# Altium schematic sheet CTRL V5.2.SchDoc
size A3
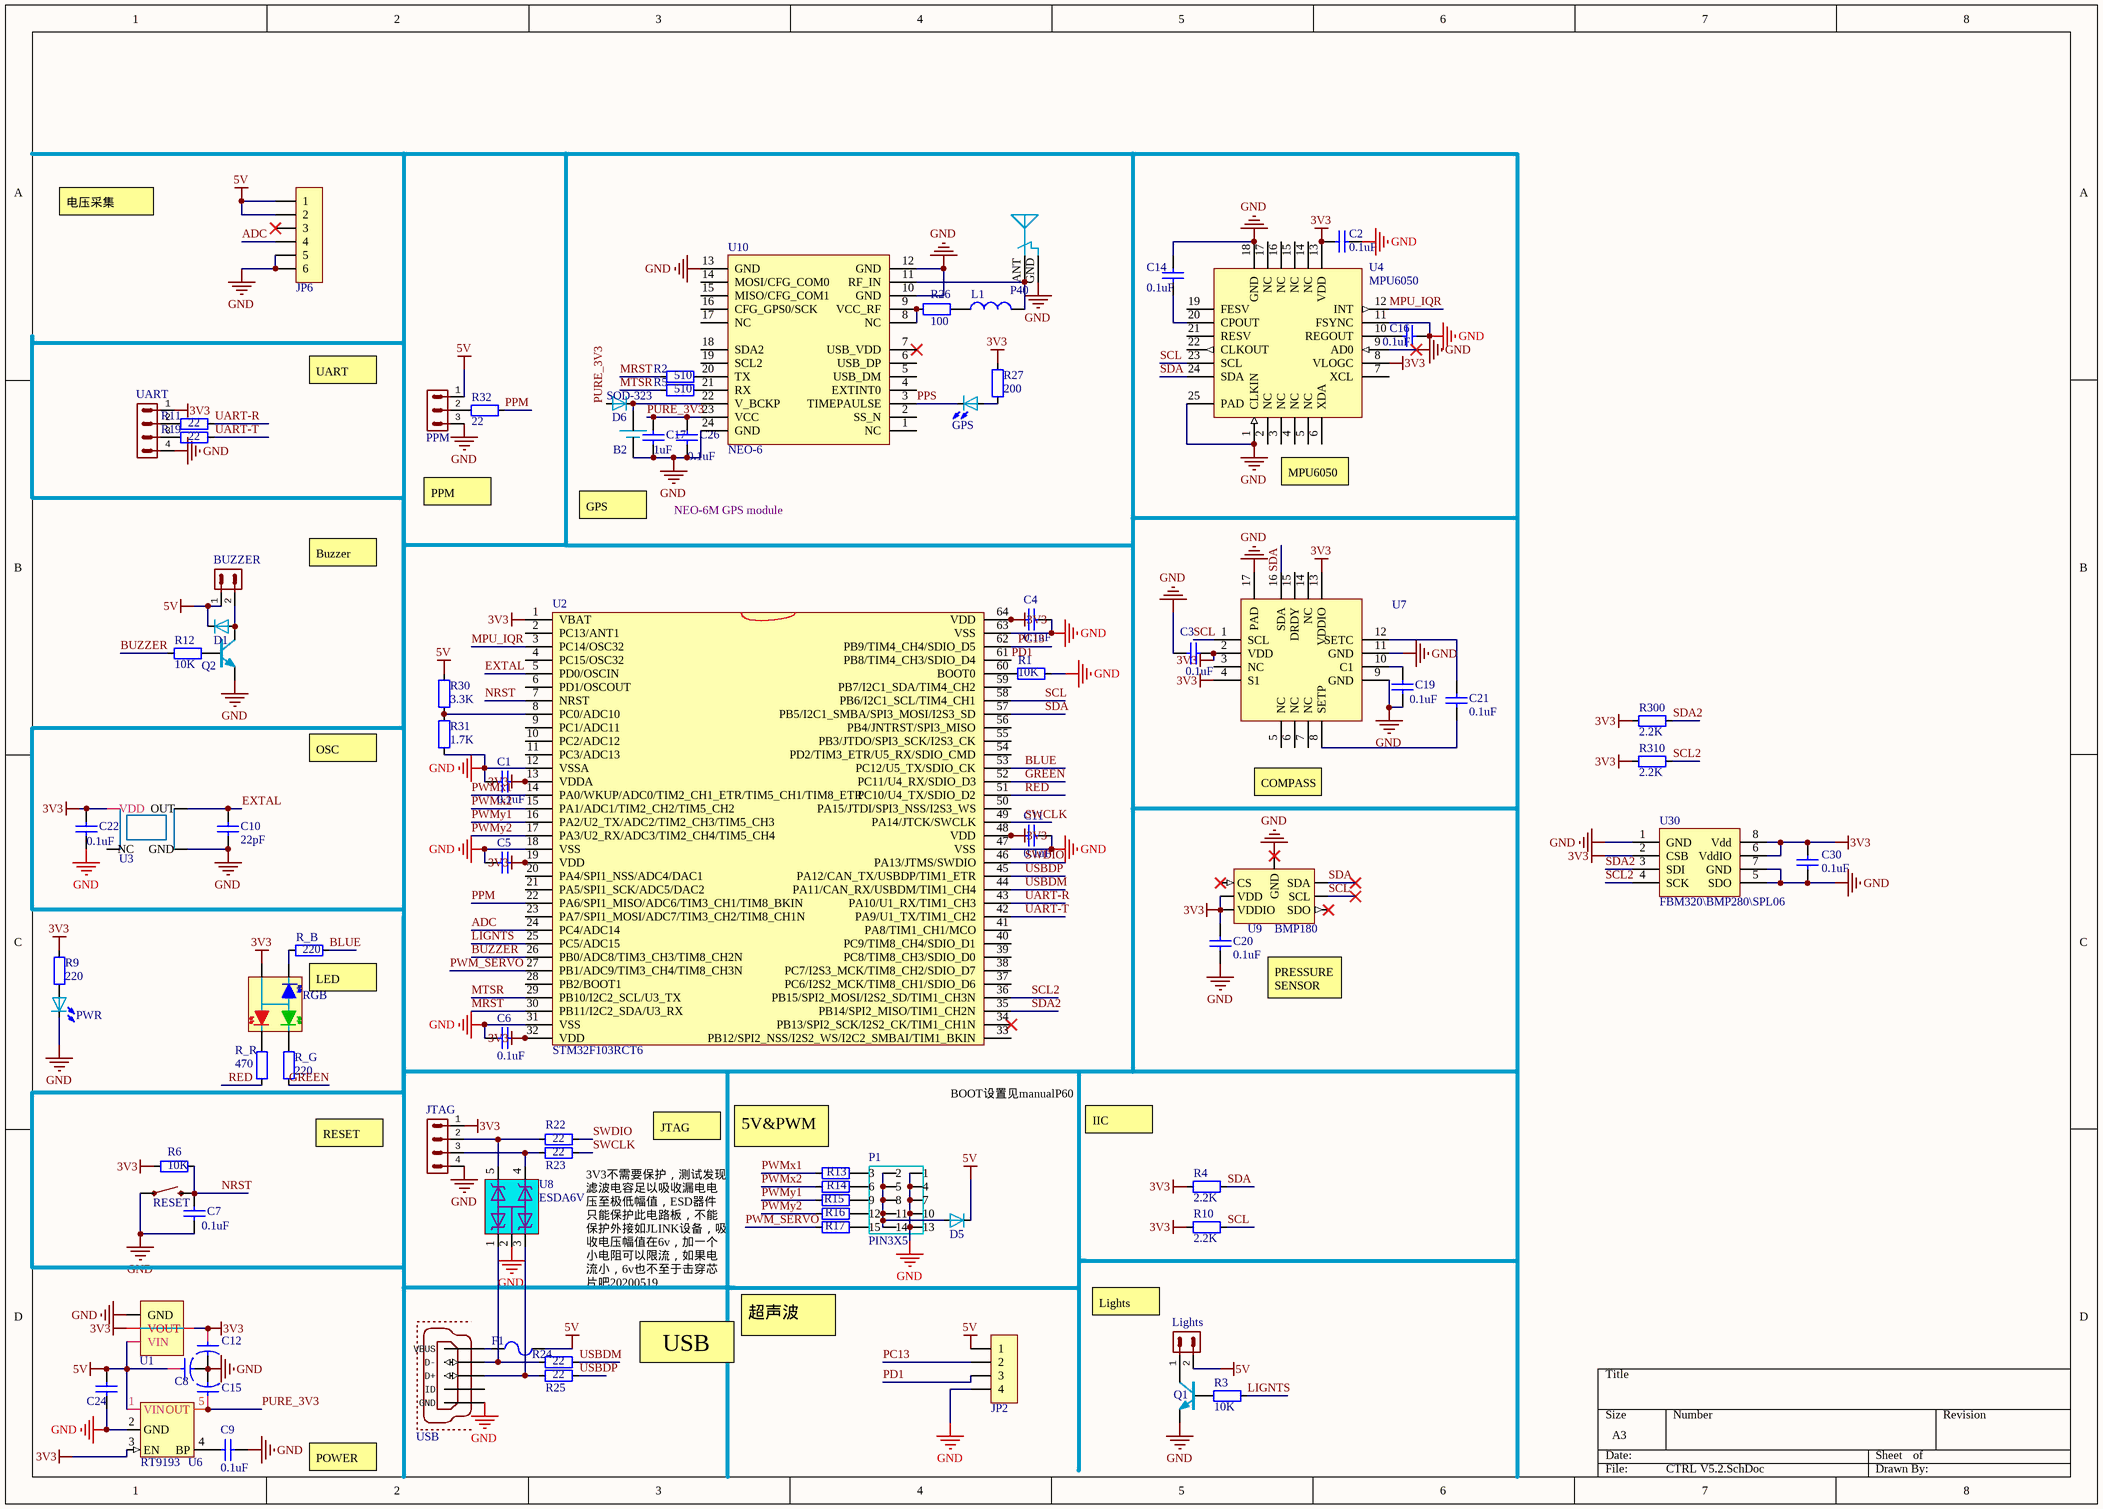
[diagram p0: CTRL V5.2.SchDoc]

## Parts
B2  XH414  [XH414]  (value not drawn)
BUZZER  DF13C-2P  [DF13C-2P-1.25V]  (value not drawn)
C1  0.1uF  [0603-CAP]
C2  0.1uF  [0603-CAP]
C3  0.1uF  [0603-CAP]
C4  0.1uF  [0603-CAP]
C5  0.1uF  [0603-CAP]  (value not drawn)
C6  0.1uF  [0603-CAP]
C7  0.1uF  [0603-CAP]
C8  10uF  [TAJ-A(1206)[3216]]  (value not drawn)
C9  0.1uF  [0603-CAP]
C10  22pF  [0603-CAP]
C11  0.1uF  [0603-CAP]
C12  10uF  [TAJ-A(1206)[3216]]  (value not drawn)
C14  0.1uF  [0603-CAP]
C15  10uF  [TAJ-A(1206)[3216]]  (value not drawn)
C16  0.1uF  [0603-CAP]
C17  1uF  [0805-CAP]
C19  0.1uF  [0603-CAP]
C20  0.1uF  [0603-CAP]
C21  0.1uF  [0603-CAP]
C22  0.1uF  [0603-CAP]
C24  0.1uF  [0805-CAP]  (value not drawn)
C26  0.1uF  [0603-CAP]
C30  value 0.1uF  [C_0603]  (hidden comment: C_0603)
D1  IN5819  [SOD-323]  (value not drawn)
D5  1N4148  [SOD-523]  (value not drawn)
D6  SOD-323  [SOD-323]
F1  FUSE  [0805-FUS]  (value not drawn)
GPS  LED  [0805-LED]  (value not drawn)
JP2  HDR-1X4  [HDR-1X4]  (value not drawn)
JP6  HDR-1X6  [TX1.25 SMD-4P]  (value not drawn)
JTAG  PIN HDR 1x4  [PIN4*1]  (value not drawn)
L1  value  [0805-IND]  (value not drawn)
Lights  DF13C-2P  [DF13C-2P-1.25V]  (value not drawn)
P1  PIN3X5  [PIN HDR3X5]
P40  IPEX  [IPEX]  (value not drawn)
PPM  PIN HDR 1X3  [PIN3*1]  (value not drawn)
PWR  LED  [0805-LED]  (value not drawn)
Q1  2N3904  [SOT-23]  (value not drawn)
Q2  2N3904  [SOT-23]  (value not drawn)
R1  10K  [0603-Res]
R2  510  [0603-Res]
R3  10K  [0603-Res]
R4  2.2K  [0603-Res]
R5  510  [0603-Res]
R6  10K  [0603-Res]
R9  220  [0603-Res]
R10  2.2K  [0603-Res]
R11  22  [0603-Res]
R12  10K  [0603-Res]
R13  220  [0603-Res]  (value not drawn)
R14  220  [0603-Res]  (value not drawn)
R15  220  [0603-Res]  (value not drawn)
R16  220  [0603-Res]  (value not drawn)
R17  220  [0603-Res]  (value not drawn)
R19  22  [0603-Res]
R22  22  [0603-Res]
R23  22  [0603-Res]
R24  22  [0603-Res]
R25  22  [0603-Res]
R26  100  [0603-Res]
R27  200  [0603-Res]
R30  3.3K  [0603-Res]
R31  1.7K  [0603-Res]
R32  22  [0603-Res]
R300  2.2K  [0603-Res]
R310  2.2K  [0603-Res]
R_B  220  [0603-Res]
R_G  220  [0603-Res]
R_R  470  [0603-Res]
RESET  KEY_2PIN  [KEY-SMD-2P-1]  (value not drawn)
RGB  3528LED  [1210-RGBLED]  (value not drawn)
U1  AMS1117-3.3  [SOT-223]  (value not drawn)
U2  STM32F103RCT6  [LQFP-64-S]
U3  5032-8M  [XTAL-5032-4P]  (value not drawn)
U4  MPU6050  [QFN-24]
U6  RT9193  [SOT23-5]
U7  HMC5883  [QFN-16-L]  (value not drawn)
U8  ESDA6V1W5(Eb1)  [SOT323-5L]
U9  BMP180  [BMP180-WITHSHELL]
U10  NEO-6  [NEO-6]
U30  FBM320\BMP280\SPL06  [LGA-2_5X2MM]
UART  SH1.0-4P  [SH1.0 S-W-4P]  (value not drawn)
USB  USB-MICRO  [USB_MICRO]  (value not drawn)

## Nets
3V3: C1.1 C2.1 C3.2 C4.2 C5.2 C6.1 C11.2 C12.A C20.2 C22.2 C30.1 JTAG.1 R4.2 R6.1 R9.1 R10.2 R27.2 R300.2 R310.2 RGB.VCC U1.2(VOUT) U1.4(VOUT) U2.1(VBAT) U2.13(VDDA) U2.19(VDD) U2.32(VDD) U2.48(VDD) U2.64(VDD) U3.4(VDD) U4.8(VLOGC) U4.13(VDD) U6.3(EN) U7.2(VDD) U7.4(S1) U7.13(VDDIO) U9.2(VDD) U9.3(VDDIO) U30.2(CSB) U30.6(VddIO) U30.8(Vdd) UART.1
5V: BUZZER.1 C8.A C24.2 D1.C D5.C F1.1 JP2.1 JP6.1 JP6.2 Lights.2 PPM.1 R30.1 U1.3(VIN) U6.1(VIN)
GND: B2.GND C1.2 C2.2 C3.1 C4.1 C5.1 C6.2 C7.1 C8.C(K) C9.2 C10.1 C11.1 C12.C(K) C14.2 C15.C(K) C16.2 C17.1 C19.1 C20.1 C22.1 C24.1 C26.1 C30.2 JP2.4 JP6.5 JP6.6 JTAG.4 P1.1 P1.4 P1.7 P1.10 P1.13 P40.GND PPM.3 PWR.C Q1.1 Q2.1 R1.1 R31.2 RESET.1 U1.1(GND) U2.12(VSSA) U2.18(VSS) U2.31(VSS) U2.47(VSS) U2.63(VSS) U3.2(GND) U4.1(CLKIN) U4.9(AD0) U4.11(FSYNC) U4.18(GND) U4.25(PAD) U6.2(GND) U7.9(GND) U7.11(GND) U7.17(PAD) U8.2(GND) U9.7(GND) U10.10(GND) U10.12(GND) U10.13(GND) U10.24(GND) U30.1(GND) U30.5(SDO) U30.7(GND) UART.4 USB.GND
ADC: JP6.4 U2.24(PC4/ADC14)
BLUE: R_B.2 U2.53(PC12/U5_TX/SDIO_CK)
BUZZER: R12.2 U2.26(PB0/ADC8/TIM3_CH3/TIM8_CH2N)
EXTAL: C10.2 U2.5(PD0/OSCIN) U3.3(OUT)
GREEN: R_G.2 U2.52(PC11/U4_RX/SDIO_D3)
LIGNTS: R3.1 U2.25(PC5/ADC15)
MPU_IQR: U2.3(PC14/OSC32) U4.12(INT)
MRST: R2.1 U2.30(PB11/I2C2_SDA/U3_RX)
MTSR: R5.1 U2.29(PB10/I2C2_SCL/U3_TX)
NRST: C7.2 R6.2 RESET.2 U2.7(NRST)
PC13: JP2.2 U2.62(PB9/TIM4_CH4/SDIO_D5)
PD1: JP2.3 U2.61(PB8/TIM4_CH3/SDIO_D4)
PPM: R32.1 U2.22(PA6/SPI1_MISO/ADC6/TIM3_CH1/TIM8_BKIN)
PPS: GPS.C U10.3(TIMEPAULSE)
PURE_3V3: C15.A C17.2 C26.2 D6.A U6.5(OUT) U10.23(VCC)
PWM_SERVO: R17.2 U2.27(PB1/ADC9/TIM3_CH4/TIM8_CH3N)
PWMx1: R13.2 U2.14(PA0/WKUP/ADC0/TIM2_CH1_ETR/TIM5_CH1/TIM8_ETR)
PWMx2: R14.2 U2.15(PA1/ADC1/TIM2_CH2/TIM5_CH2)
PWMy1: R15.2 U2.16(PA2/U2_TX/ADC2/TIM2_CH3/TIM5_CH3)
PWMy2: R16.2 U2.17(PA3/U2_RX/ADC3/TIM2_CH4/TIM5_CH4)
RED: R_R.2 U2.51(PC10/U4_TX/SDIO_D2)
SCL: R10.1 U2.58(PB6/I2C1_SCL/TIM4_CH1) U4.23(SCL) U7.1(SCL) U9.5(SCL)
SCL2: R310.1 U2.36(PB15/SPI2_MOSI/I2S2_SD/TIM1_CH3N) U30.4(SCK)
SDA: R4.1 U2.57(PB5/I2C1_SMBA/SPI3_MOSI/I2S3_SD) U4.24(SDA) U7.16(SDA) U9.6(SDA)
SDA2: R300.1 U2.35(PB14/SPI2_MISO/TIM1_CH2N) U30.3(SDI)
SWCLK: R23.2 U2.49(PA14/JTCK/SWCLK)
SWDIO: R22.2 U2.46(PA13/JTMS/SWDIO)
UART-R: R11.2 U2.43(PA10/U1_RX/TIM1_CH3)
UART-T: R19.2 U2.42(PA9/U1_TX/TIM1_CH2)
USBDM: R24.2 U2.44(PA11/CAN_RX/USBDM/TIM1_CH4)
USBDP: R25.2 U2.45(PA12/CAN_TX/USBDP/TIM1_ETR)
NetB2_VCC: B2.VCC D6.C U10.22(V_BCKP)
NetBUZZER_2: BUZZER.2 D1.A Q2.3
NetC9_1: C9.1 U6.4(BP)
NetC14_1: C14.1 U4.20(CPOUT)
NetC16_1: C16.1 U4.10(REGOUT)
NetC19_2: C19.2 U7.10(C1)
NetC21_1: C21.1 U7.8(SETP)
NetC21_2: C21.2 U7.12(SETC)
NetD5_A: D5.A P1.2 P1.5 P1.8 P1.11 P1.14
NetF1_2: F1.2 USB.VBUS
NetGPS_A: GPS.A R27.1
NetJTAG_2: JTAG.2 R22.1 U8.5(D4)
NetJTAG_3: JTAG.3 R23.1 U8.4(D3)
NetL1_1: L1.1 R26.2
NetL1_2: L1.2 P40.ANT U10.11(RF_IN)
NetLights_1: Lights.1 Q1.3
NetP1_3: P1.3 R13.1
NetP1_6: P1.6 R14.1
NetP1_9: P1.9 R15.1
NetP1_12: P1.12 R16.1
NetP1_15: P1.15 R17.1
NetPPM_2: PPM.2 R32.2
NetPWR_A: PWR.A R9.2
NetQ1_2: Q1.2 R3.2
NetQ2_2: Q2.2 R12.1
NetR1_2: R1.2 U2.60(BOOT0)
NetR2_2: R2.2 U10.20(TX)
NetR5_2: R5.2 U10.21(RX)
NetR11_1: R11.1 UART.2
NetR19_1: R19.1 UART.3
NetR24_1: R24.1 U8.1(D1) USB.D-
NetR25_1: R25.1 U8.3(D2) USB.D+
NetR26_1: R26.1 U10.8(NC) U10.9(VCC_RF)
NetR30_2: R30.2 R31.1 U2.8(PC0/ADC10)
NetR_B_1: R_B.1 RGB.B
NetR_G_1: R_G.1 RGB.G
NetR_R_1: R_R.1 RGB.R

Not connected (* = marked no-connect by the designer): JP6 3*; U2 2(PC13/ANT1) 4(PC15/OSC32) 6(PD1/OSCOUT) 9(PC1/ADC11) 10(PC2/ADC12) 11(PC3/ADC13) 20(PA4/SPI1_NSS/ADC4/DAC1) 21(PA5/SPI1_SCK/ADC5/DAC2) 23(PA7/SPI1_MOSI/ADC7/TIM3_CH2/TIM8_CH1N) 28(PB2/BOOT1) 33(PB12/SPI2_NSS/I2S2_WS/I2C2_SMBAI/TIM1_BKIN) 34(PB13/SPI2_SCK/I2S2_CK/TIM1_CH1N)* 37(PC6/I2S2_MCK/TIM8_CH1/SDIO_D6) 38(PC7/I2S3_MCK/TIM8_CH2/SDIO_D7) 39(PC8/TIM8_CH3/SDIO_D0) 40(PC9/TIM8_CH4/SDIO_D1) 41(PA8/TIM1_CH1/MCO) 50(PA15/JTDI/SPI3_NSS/I2S3_WS) 54(PD2/TIM3_ETR/U5_RX/SDIO_CMD) 55(PB3/JTDO/SPI3_SCK/I2S3_CK) 56(PB4/JNTRST/SPI3_MISO) 59(PB7/I2C1_SDA/TIM4_CH2); U3 1(NC); U4 2(NC) 3(NC) 4(NC) 5(NC) 6(XDA) 7(XCL) 14(NC) 15(NC) 16(NC) 17(NC) 19(FESV) 21(RESV) 22(CLKOUT); U7 3(NC) 5(NC) 6(NC) 7(NC) 14(NC) 15(DRDY); U9 1(CS)* 4(SDO)*; U10 1(NC) 2(SS_N) 4(EXTINT0) 5(USB_DM) 6(USB_DP) 7(USB_VDD)* 14(MOSI/CFG_COM0) 15(MISO/CFG_COM1) 16(CFG_GPS0/SCK) 17(NC) 18(SDA2) 19(SCL2); USB ID

## Notes on the sheet
- 电压采集
- UART
- PPM
- GPS
- NEO-6M GPS module
- (near U4) MPU6050
- Buzzer
- OSC
- COMPASS
- LED
- PRESSURE SENSOR
- BOOT设置见manualP60
- IIC
- RESET
- JTAG
- 5V&PWM
- 3V3不需要保护，测试发现滤波电容足以吸收漏电电压至极低幅值，ESD器件只能保护此电路板，不能保护外接如JLINK设备，吸收电压幅值在6v，加一个小电阻可以限流，如果电流小，6v也不至于击穿芯片吧20200519
- Lights
- USB
- 超声波
- POWER

## Library data of the parts
B2 = XH414: XH414贴片法拉电容φ4.7
BUZZER = PIN HDR 1x2: DF13C-2PHeader, 2-Pin; LatestRevisionDate: 17-Jul-2002; LatestRevisionNote: Re-released for DXP Platform.; Publisher: Altium Limited
C1-C7 C9 C11 C14 C16 C19-C22 C24 C26 = Cap: 无极性Cap; Voltage: 50V; Published: 8-Jun-2000; LatestRevisionDate: 17-Jul-2002; LatestRevisionNote: Re-released for DXP Platform.; PackageReference: RAD-0.3; Publisher: Altium Limited; PackageDescription: Radial Cap, Thru-Hole; 2 Leads; 0.3 in Pin Spacing; Footprint: 0603; Value: 0.1uF
C8 C12 C15 = Cap_p: 有极性Cap
C10 C17 = Cap: 无极性Cap; Voltage: 50V; Value: 0.1uF; Published: 8-Jun-2000; LatestRevisionDate: 17-Jul-2002; LatestRevisionNote: Re-released for DXP Platform.; PackageReference: RAD-0.3; Publisher: Altium Limited; PackageDescription: Radial Cap, Thru-Hole; 2 Leads; 0.3 in Pin Spacing; Footprint: 0603
D1 = DIODE: 续流
D5 D6 = DIODE
F1 = FUSE: 熔断器
JP2 = Header 4: 4P接插件; 版权归属: 源创客; BOM名称: 4P接插件; 学习资源: www.ooocke.com
JP6 = Header 6: 6P接插件; 版权归属: 源创客; BOM名称: 6P接插件; 学习资源: www.ooocke.com
JTAG = PIN HDR 1x4: 1x4-Pin-connector-JTAG; LatestRevisionDate: 17-Jul-2002; LatestRevisionNote: Re-released for DXP Platform.; Publisher: Altium Limited
L1 = Inductor: 电感; value: 27nH
Lights = PIN HDR 1x2: Header, 2-Pin; LatestRevisionDate: 17-Jul-2002; LatestRevisionNote: Re-released for DXP Platform.; Publisher: Altium Limited
P1 = PIN HDR3x5
P40 = IPEX: IPEX天线座
Q1 Q2 = NPN: NPN三极管
R1 R3 R4 R6 R9-R17 R19 R22-R27 R30-R32 R300 R310 R_B R_G R_R = Res: Resistor; Value: 1K; Published: 8-Jun-2000; LatestRevisionDate: 17-Jul-2002; LatestRevisionNote: Re-released for DXP Platform.; PackageReference: AXIAL-0.4; Publisher: Altium Limited; Footprint: 0603
R2 R5 = RES: Resistor; Value: 1K; Published: 8-Jun-2000; LatestRevisionDate: 17-Jul-2002; LatestRevisionNote: Re-released for DXP Platform.; PackageReference: AXIAL-0.4; Publisher: Altium Limited
RGB = LED-RGB-4PIN
U1 = AMS1117
U3 = XTAL-5032-4P: 4PIN-5032晶振
U4 = MPU6050: dscrps三轴陀螺仪加速度计
U7 = HMC5883: 地磁计
U8 = ESDA6V1W5(Eb1): ESD protection
U9 = BMP180: Special BOSCH pressure sensor
U10 = NEO-6: GPS
U30 = FBM320: 气压计; Published: 8-August-2017; Publisher: mazhongwei; PackageReference: LGA-2_5X2MM
UART = PIN HDR 1x4: SH1.0-4P 1x4-Pin-connector; LatestRevisionDate: 17-Jul-2002; LatestRevisionNote: Re-released for DXP Platform.; Publisher: Altium Limited
USB = USB
C30 = C_0603: Published: 8-Jun-2000; LatestRevisionDate: 17-Jul-2002; LatestRevisionNote: Re-released for DXP Platform.; PackageReference: RAD-0.3; Publisher: Altium Limited; PackageDescription: Radial Cap, Thru-Hole; 2 Leads; 0.3 in Pin Spacing